# EAGLE design AeroQuad_v17 (EAGLE 5.07)
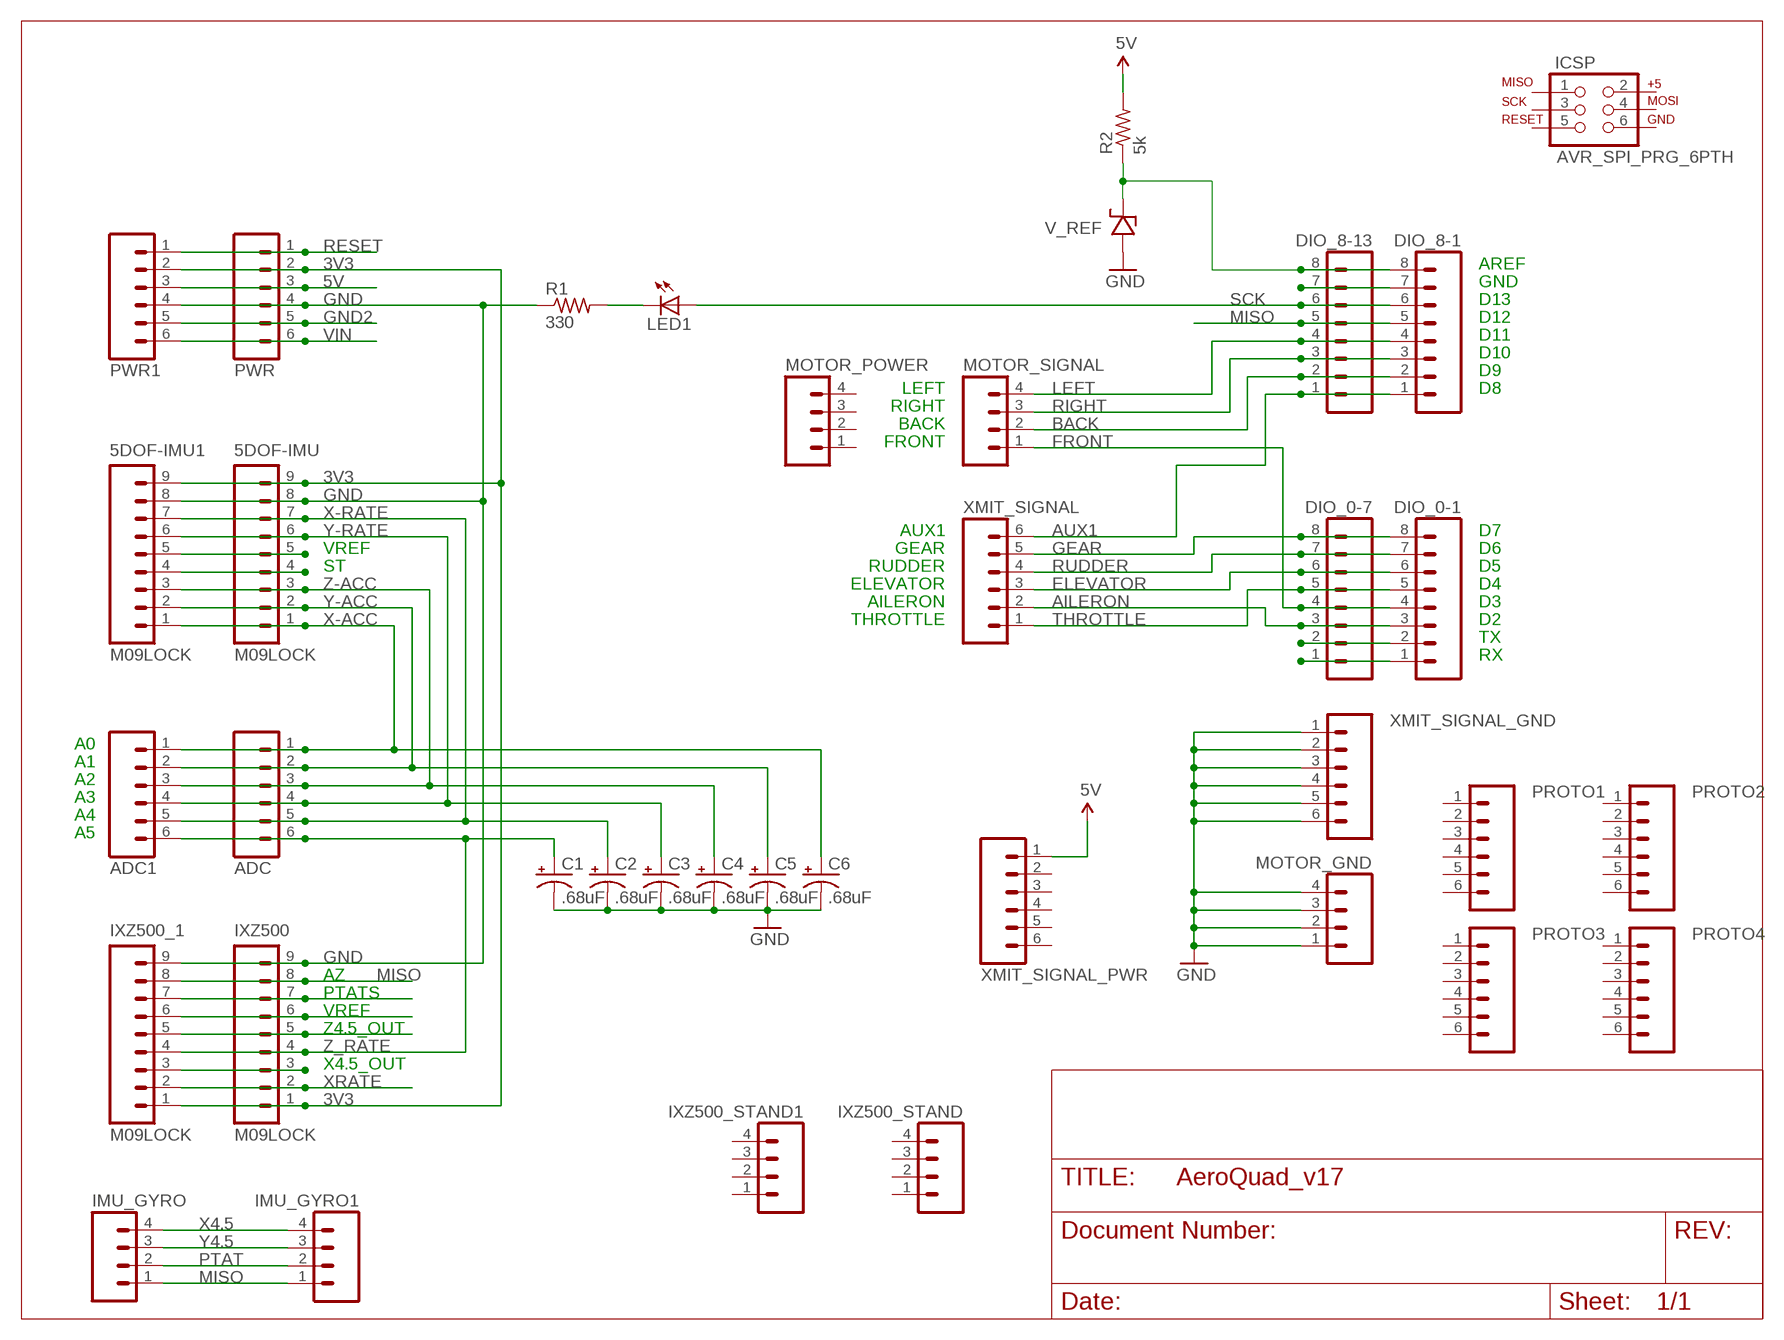
[diagram p0: schematic, sheet 1]

## Parts
5DOF-IMU  M09LOCK  [1X09_LOCK]
5DOF-IMU1  M09LOCK  [1X09_LOCK]
ADC  M06LOCK  [1X06_LOCK]
ADC1  M06LOCK  [1X06_LOCK]
C1  .68uF  CAP_POLPTH2  [CPOL-RADIAL-10UF-25V]
C2  .68uF  CAP_POLPTH2  [CPOL-RADIAL-10UF-25V]
C3  .68uF  CAP_POLPTH2  [CPOL-RADIAL-10UF-25V]
C4  .68uF  CAP_POLPTH2  [CPOL-RADIAL-10UF-25V]
C5  .68uF  CAP_POLPTH2  [CPOL-RADIAL-10UF-25V]
C6  .68uF  CAP_POLPTH2  [CPOL-RADIAL-10UF-25V]
DIO_0-1  M08LOCK  [1X08_LOCK]
DIO_0-7  M08LOCK  [1X08_LOCK]
DIO_8-1  M08LOCK  [1X08_LOCK]
DIO_8-13  M08LOCK  [1X08_LOCK]
ICSP  AVR_SPI_PRG_6PTH  [2X3]
IMU_GYRO  M04LOCK  [1X04_LOCK]
IMU_GYRO1  M04LOCK  [1X04_LOCK]
IXZ500  M09LOCK  [1X09_LOCK]
IXZ500_1  M09LOCK  [1X09_LOCK]
IXZ500_STAND  M04LOCK  [1X04_LOCK]
IXZ500_STAND1  M04LOCK  [1X04_LOCK]
LED1  LED5MM  [LED5MM]
MOTOR_GND  M04LOCK  [1X04_LOCK]
MOTOR_POWER  M04LOCK  [1X04_LOCK]
MOTOR_SIGNAL  M04LOCK  [1X04_LOCK]
PROTO1  M06SIP  [1X06]
PROTO2  M06SIP  [1X06]
PROTO3  M06SIP  [1X06]
PROTO4  M06SIP  [1X06]
PWR  M06LOCK  [1X06_LOCK]
PWR1  M06LOCK  [1X06_LOCK]
R1  330  R-US_0204/5  [0204/5]
R2  5k  R-US_0204/5  [0204/5]
V_REF  LM4040-3V  [TO-92]
XMIT_SIGNAL  M06LOCK  [1X06_LOCK]
XMIT_SIGNAL_GND  M06LOCK  [1X06_LOCK]
XMIT_SIGNAL_PWR  M06LOCK  [1X06_LOCK]

## Nets
3V3: 5DOF-IMU1.9 5DOF-IMU.9 IXZ500.1 IXZ500_1.1 PWR1.2 PWR.2
5V: PWR1.3 PWR.3 R2.2 XMIT_SIGNAL_PWR.1
AILERON: DIO_0-1.3 DIO_0-7.3 XMIT_SIGNAL.2
AREF: DIO_8-1.8 DIO_8-13.8 R2.1 V_REF.2(CATHODE)
AUX1: DIO_8-1.1 DIO_8-13.1 XMIT_SIGNAL.6
BACK: DIO_8-1.2 DIO_8-13.2 MOTOR_SIGNAL.2
ELEVATOR: DIO_0-1.6 DIO_0-7.6 XMIT_SIGNAL.3
FRONT: DIO_0-1.4 DIO_0-7.4 MOTOR_SIGNAL.1
GEAR: DIO_0-1.8 DIO_0-7.8 XMIT_SIGNAL.5
GND: 5DOF-IMU1.8 5DOF-IMU.8 C1.2(-) C2.2(-) C3.2(-) C4.2(-) C5.2(-) C6.2(-) IXZ500.9 IXZ500_1.9 MOTOR_GND.1 MOTOR_GND.2 MOTOR_GND.3 MOTOR_GND.4 PWR1.4 PWR.4 R1.1 V_REF.1(ANODE) XMIT_SIGNAL_GND.1 XMIT_SIGNAL_GND.2 XMIT_SIGNAL_GND.3 XMIT_SIGNAL_GND.4 XMIT_SIGNAL_GND.5 XMIT_SIGNAL_GND.6
GND2: PWR1.5 PWR.5
LEFT: DIO_8-1.4 DIO_8-13.4 MOTOR_SIGNAL.4
MISO: DIO_8-1.5 DIO_8-13.5 IMU_GYRO1.1 IMU_GYRO.1 IXZ500.8 IXZ500_1.8
N$1: DIO_8-1.7 DIO_8-13.7
N$2: LED1.K(C) R1.2
N$9: 5DOF-IMU1.5 5DOF-IMU.5
N$11: 5DOF-IMU1.4 5DOF-IMU.4
N$13: IXZ500.7 IXZ500_1.7
N$15: IXZ500.6 IXZ500_1.6
N$16: IXZ500.5 IXZ500_1.5
N$18: IXZ500.3 IXZ500_1.3
N$25: DIO_0-1.2 DIO_0-7.2
N$26: DIO_0-1.1 DIO_0-7.1
PTAT: IMU_GYRO1.2 IMU_GYRO.2
RESET: PWR1.1 PWR.1
RIGHT: DIO_8-1.3 DIO_8-13.3 MOTOR_SIGNAL.3
RUDDER: DIO_0-1.7 DIO_0-7.7 XMIT_SIGNAL.4
SCK: DIO_8-1.6 DIO_8-13.6 LED1.A
THROTTLE: DIO_0-1.5 DIO_0-7.5 XMIT_SIGNAL.1
VIN: PWR1.6 PWR.6
X4.5: IMU_GYRO1.4 IMU_GYRO.4
X-ACC: 5DOF-IMU1.1 5DOF-IMU.1 ADC1.1 ADC.1 C6.1(+)
X-RATE: 5DOF-IMU1.7 5DOF-IMU.7 ADC1.5 ADC.5 C2.1(+)
XRATE: IXZ500.2 IXZ500_1.2
Y4.5: IMU_GYRO1.3 IMU_GYRO.3
Y-ACC: 5DOF-IMU1.2 5DOF-IMU.2 ADC1.2 ADC.2 C5.1(+)
Y-RATE: 5DOF-IMU1.6 5DOF-IMU.6 ADC1.4 ADC.4 C3.1(+)
Z-ACC: 5DOF-IMU1.3 5DOF-IMU.3 ADC1.3 ADC.3 C4.1(+)
Z_RATE: ADC1.6 ADC.6 C1.1(+) IXZ500.4 IXZ500_1.4
Unconnected: ICSP.1 ICSP.2 ICSP.3 ICSP.4 ICSP.5 ICSP.6 IXZ500_STAND1.1 IXZ500_STAND1.2 IXZ500_STAND1.3 IXZ500_STAND1.4 IXZ500_STAND.1 IXZ500_STAND.2 IXZ500_STAND.3 IXZ500_STAND.4 MOTOR_POWER.1 MOTOR_POWER.2 MOTOR_POWER.3 MOTOR_POWER.4 PROTO1.1 PROTO1.2 PROTO1.3 PROTO1.4 PROTO1.5 PROTO1.6 PROTO2.1 PROTO2.2 PROTO2.3 PROTO2.4 PROTO2.5 PROTO2.6 PROTO3.1 PROTO3.2 PROTO3.3 PROTO3.4 PROTO3.5 PROTO3.6 PROTO4.1 PROTO4.2 PROTO4.3 PROTO4.4 PROTO4.5 PROTO4.6 V_REF.3(NC) XMIT_SIGNAL_PWR.2 XMIT_SIGNAL_PWR.3 XMIT_SIGNAL_PWR.4 XMIT_SIGNAL_PWR.5 XMIT_SIGNAL_PWR.6

## Notes on the sheet
- AREF
- GND
- D13
- D12
- D11
- D10
- D9
- LEFT | D8
- RIGHT
- BACK
- FRONT
- AUX1 | D7
- VREF | GEAR | D6
- ST | RUDDER | D5
- ELEVATOR | D4
- AILERON | D3
- THROTTLE | D2
- TX
- RX
- A0
- A1
- A2
- A3
- A4
- A5
- AZ
- PTATS
- VREF
- Z4.5_OUT
- X4.5_OUT

## Library data of the parts
5DOF-IMU 5DOF-IMU1 IXZ500 IXZ500_1 = SparkFun:M09: Header 9 Standard 9-pin 0.1" header. Use with straight break away headers (SKU : PRT-00116), right angle break away headers (PRT-00553), swiss pins (PRT-00743), machine pins (PRT-00117), and female headers (PRT-00115).
ADC ADC1 PROTO1-PROTO4 PWR PWR1 XMIT_SIGNAL XMIT_SIGNAL_GND XMIT_SIGNAL_PWR = SparkFun:M06: Header 6 Standard 6-pin 0.1" header. Use with straight break away headers (SKU : PRT-00116), right angle break away headers (PRT-00553), swiss pins (PRT-00743), machine pins (PRT-00117), and female headers (PRT-00115). Molex polarized connector foot print use with SKU : PRT-08094 with associated crimp pins and housings. NOTES ON THE VARIANTS LOCK and LOCK_LONGPADS... This footprint was designed to help hold the alignment of a through-hole component (i.e. 6-pin header) while soldering it into place. You may notice that each hole has been shifted either up or down by 0.005 of an inch from it's more standard position (which is a perfectly straight line). This slight alteration caused the pins (the squares in the middle) to touch the edges of the holes. Because they are alternating, it causes a "brace" to hold the component in place. 0.005 has proven to be the perfect amount of "off-center" position when using our standard breakaway headers. Although looks a little odd when you look at the bare footprint, once you have a header in there, the alteration is very hard to notice. Also, if you push a header all the way into place, it is covered up entirely on the bottom side. This idea of altering the position of holes to aid alignment will be further integrated into the Sparkfun Library for other footprints. It can help hold any component with 3 or more connection pins.
C1-C6 = SparkFun:CAP_POL: Capacitor Polarized These are standard SMD and PTH capacitors. Normally 10uF, 47uF, and 100uF in electrolytic and tantalum varieties. Always verify the external diameter of the through hole cap, it varies with capacity, voltage, and manufacturer. The EIA devices should be standard.
DIO_0-1 DIO_0-7 DIO_8-1 DIO_8-13 = SparkFun:M08: Header 8 Standard 8-pin 0.1" header. Use with straight break away headers (SKU : PRT-00116), right angle break away headers (PRT-00553), swiss pins (PRT-00743), machine pins (PRT-00117), and female headers (PRT-00115).
ICSP = SparkFun:AVR_SPI_PRG_6: AVR ISP 6 Pin This is the reduced ISP connector for AVR programming. Common on Arduino. This footprint will take up less PCB space and can be used with a 10-pin to 6-pin adapter such as SKU: BOB-08508
IMU_GYRO IMU_GYRO1 IXZ500_STAND IXZ500_STAND1 MOTOR_GND MOTOR_POWER MOTOR_SIGNAL = SparkFun:M04: Header 4 Standard 4-pin 0.1" header. Use with straight break away headers (SKU : PRT-00116), right angle break away headers (PRT-00553), swiss pins (PRT-00743), machine pins (PRT-00117), and female headers (PRT-00115). Molex polarized connector foot print use with SKU : PRT-08231 with associated crimp pins and housings.
LED1 = SparkFun:LED: LEDs Standard schematic elements and footprints for 5mm, 3mm, 1206, and 0603 sized LEDs. 5mm - Spark Fun Electronics SKU : COM-00529 (and others)
R1 R2 = resistor:R-US_: RESISTOR, American symbol
V_REF = CaranchoEngineering:LM4040: The LM4040 series of shunt voltage references are versatile, easy-to-use references that cater to a vast array of applications. The 2-pin fixed-output device requires no external capacitors for operation and is stable with all capacitive loads. Additionally, the reference offers low dynamic impedance, low noise, and low temperature coefficient to ensure a stable output voltage over a wide range of operating currents and temperatures.

## Board
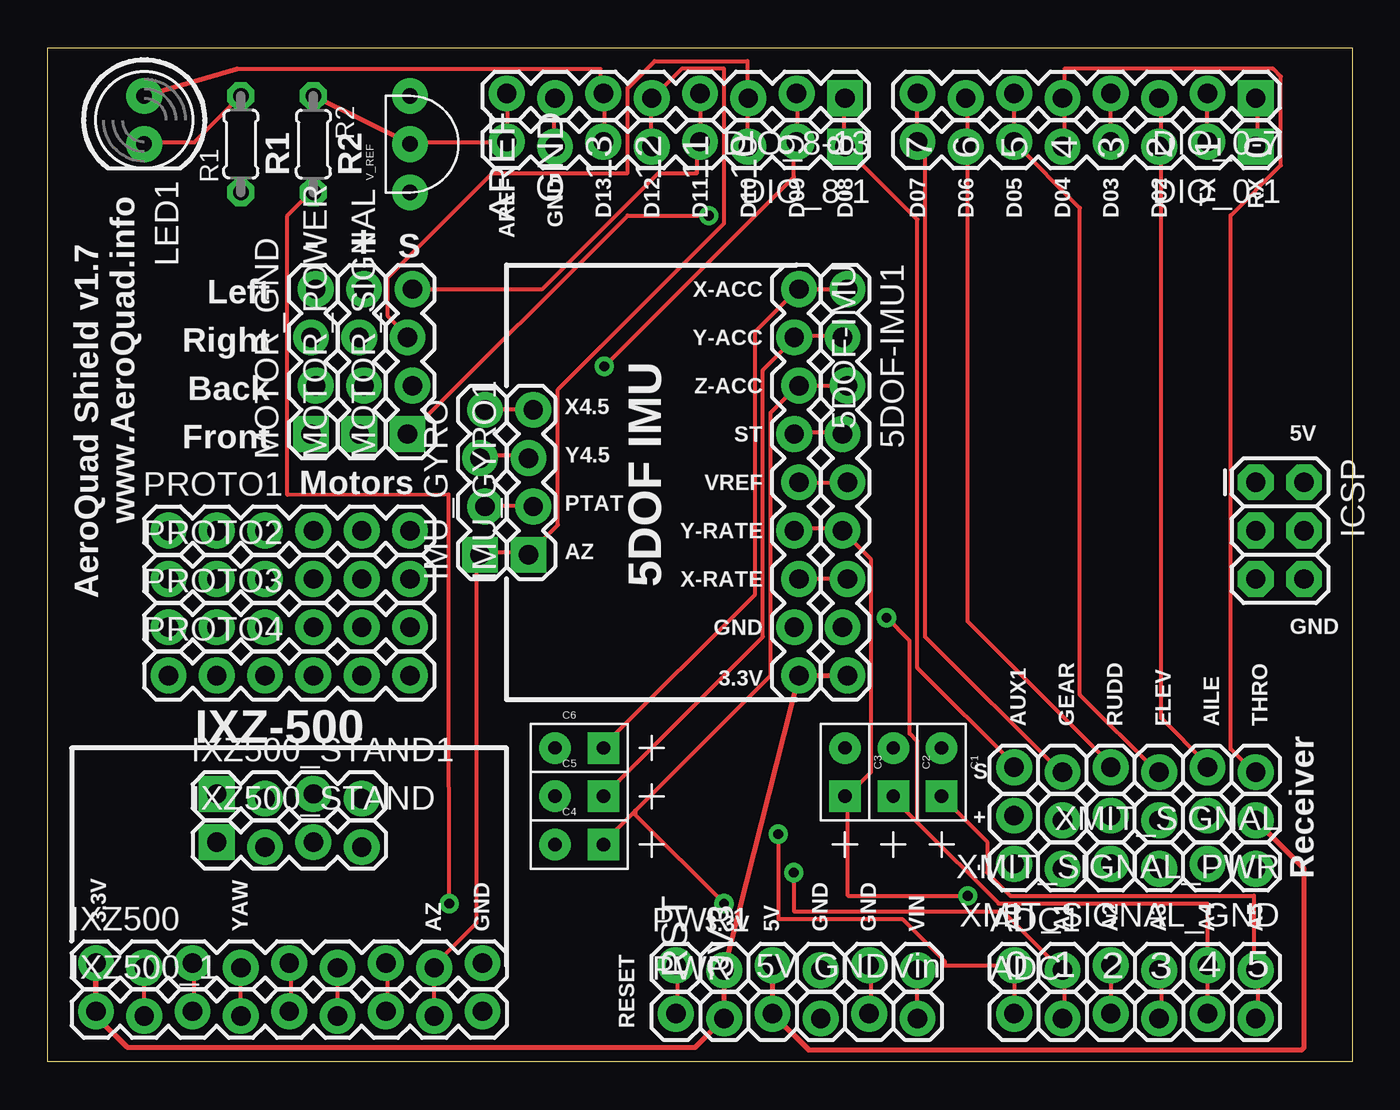
[diagram p1: board, top side]
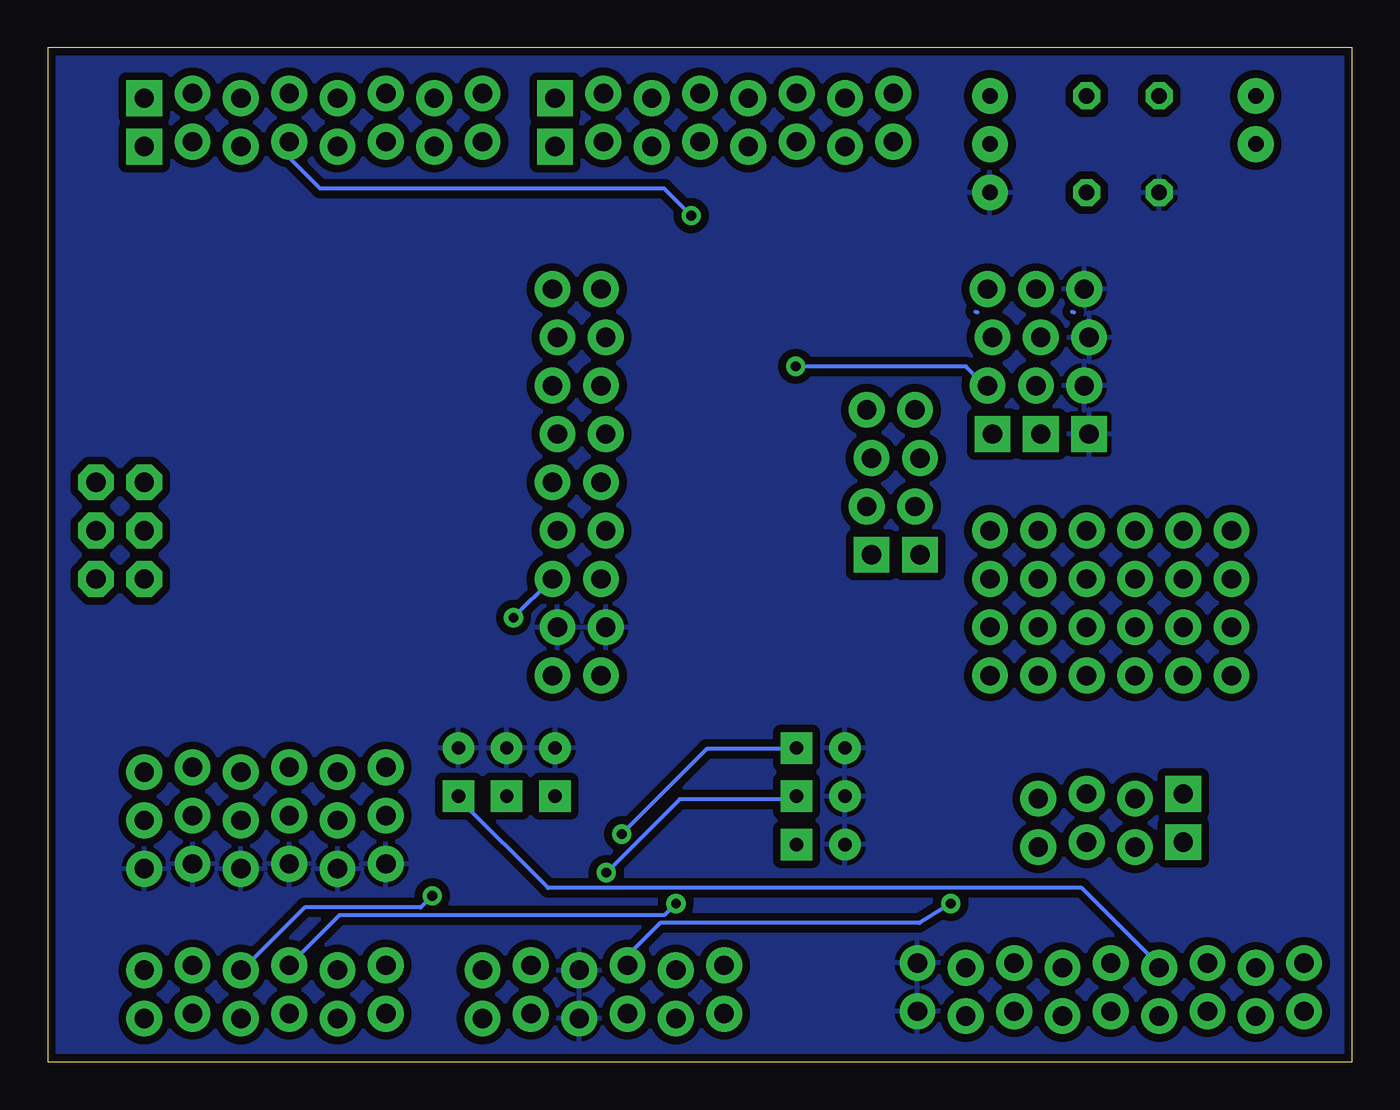
[diagram p2: board, bottom side, seen from below]

Size 68.58 x 53.34 mm. Coordinates in mm from the lower left corner, seen from the top.
Outline: 0,53.34 68.58,53.34 68.58,0 0,0 0,53.34
Copper layers (1*16): Top 0.035mm / dielectric 1.5mm / Bottom 0.035mm
Design rules "SparkFun": minimum track width 8mil, minimum drill 20mil, track to track 8mil, track to pad 8mil, pad to pad 8mil, via to via 8mil, smd to smd 8mil, copper to edge 10mil, drill to drill 8mil, minimum pad ring 12mil, minimum via ring 10mil, stop-mask expansion 4mil, vias tented up to drill 25mil, thermal gap 10mil

### Footprints (pad centres in the part's own frame; a part is rotated, then mirrored left to right if it is on the bottom)
1X09_LOCK = drill 1.016 pad 1.88 round: 1 0,0.127; 2 2.54,-0.127; 3 5.08,0.127; 4 7.62,-0.127; 5 10.16,0.127; 6 12.7,-0.127; 7 15.24,0.127; 8 17.78,-0.127; 9 20.32,0.127
1X06_LOCK = drill 1.016 pad 1.88 round: 1 0,0; 2 2.54,-0.254; 3 5.08,0; 4 7.62,-0.254; 5 10.16,0; 6 12.7,-0.254
CPOL-RADIAL-10UF-25V = drill 0.7 pad 1.651 square: 1 1.27,0 | drill 0.7 pad 1.651 round: 2 -1.27,0
1X08_LOCK = drill 1.016 pad 1.88 square: 1 0,0.127 | drill 1.016 pad 1.88 round: 2 2.54,-0.127; 3 5.08,0.127; 4 7.62,-0.127; 5 10.16,0.127; 6 12.7,-0.127; 7 15.24,0.127; 8 17.78,-0.127
2X3 = drill 1.016 pad 1.88 octagon: 1 0,0; 2 0,2.54; 3 2.54,0; 4 2.54,2.54; 5 5.08,0; 6 5.08,2.54
1X04_LOCK = drill 1.016 pad 1.88 square: 1 0,0.127 | drill 1.016 pad 1.88 round: 2 2.54,-0.127; 3 5.08,0.127; 4 7.62,-0.127
LED5MM = drill 0.813 pad 1.88 round: A -1.27,0; K 1.27,0
1X06 = drill 1.016 pad 1.88 round: 1 0,0; 2 2.54,0; 3 5.08,0; 4 7.62,0; 5 10.16,0; 6 12.7,0
0204/5 = drill 0.813 octagon: 1 -2.54,0; 2 2.54,0
TO-92 = drill 0.813 pad 1.88 round: 1 -2.54,0; 2 0,0; 3 2.54,0

### Placement (x,y rotation side)
5DOF-IMU  39.37,40.64 270 top
5DOF-IMU1  41.91,40.64 270 top
ADC  50.8,2.54 0 top
ADC1  50.8,5.08 0 top
C1  46.99,15.24 270 top
C2  44.45,15.24 270 top
C3  41.91,15.24 270 top
C4  27.94,11.43 0 top
C5  27.94,13.97 0 top
C6  27.94,16.51 0 top
DIO_0-1  63.5,48.26 180 top
DIO_0-7  63.5,50.8 180 top
DIO_8-1  41.91,48.26 180 top
DIO_8-13  41.91,50.8 180 top
ICSP  63.5,30.48 270 top
IMU_GYRO  22.86,26.67 90 top
IMU_GYRO1  25.4,26.67 90 top
IXZ500  2.54,5.08 0 top
IXZ500_1  2.54,2.54 0 top
IXZ500_STAND  8.89,11.43 0 top
IXZ500_STAND1  8.89,13.97 0 top
LED1  5.08,49.53 270 top
MOTOR_GND  13.97,33.02 90 top
MOTOR_POWER  16.51,33.02 90 top
MOTOR_SIGNAL  19.05,33.02 90 top
PROTO1  6.35,27.94 0 top
PROTO2  6.35,25.4 0 top
PROTO3  6.35,22.86 0 top
PROTO4  6.35,20.32 0 top
PWR  33.02,2.54 0 top
PWR1  33.02,5.08 0 top
R1  10.16,48.26 90 top
R2  13.97,48.26 270 top
V_REF  19.05,48.26 90 top
XMIT_SIGNAL  63.5,15.24 180 top
XMIT_SIGNAL_GND  63.5,10.16 180 top
XMIT_SIGNAL_PWR  63.5,12.7 180 top

### Tracks (layer width: path | path; a pad name or v marks a point on that pad's centre or on a via)
3V3
  Top 0.254: IXZ500_1.1 IXZ500.1 2.54,2.41 4.19,0.76 34.04,0.76 PWR.2 PWR1.2 5DOF-IMU.9 5DOF-IMU1.9
5V  (via drill 0.51)
  Top 0.203: v21.11,8.33 21.11,10.57 21.08,18.34 21.08,29.84 12.6,29.82 12.6,44.5 13.82,45.72 R2.2
  Top 0.254: XMIT_SIGNAL_PWR.1 66.04,10.16 66.04,0.76 65.91,0.64 40.01,0.64 PWR.3 PWR1.3
  Bottom 0.203: v21.11,8.33 22.76,7.32 36.37,7.32 38,5.69 38,5.08 PWR1.3
AILERON
  Top 0.203: DIO_0-7.3 58.52,50.6 58.52,48.16 DIO_0-1.3 58.52,47.95 58.52,18.09 60.96,15.65 XMIT_SIGNAL.2
AREF
  Top 0.203: DIO_8-13.8 24.18,50.8 24.18,48.56 DIO_8-1.8 23.98,48.36 19.1,48.36 V_REF.2 18.9,48.36
  Top 0.254: R2.1 18.9,48.36
AUX1
  Top 0.203: DIO_8-13.1 41.86,50.6 41.86,48.16 DIO_8-1.1 42.06,47.95 45.72,44.3 45.72,20.73 50.8,15.65 XMIT_SIGNAL.6
BACK  (via drill 0.51)
  Top 0.203: v29.26,36.58 39.22,46.53 39.22,48.36 DIO_8-1.2 39.42,48.56 39.42,50.8 DIO_8-13.2
  Bottom 0.203: v29.26,36.58 20.32,36.58 19.3,35.56 MOTOR_SIGNAL.2
ELEVATOR
  Top 0.203: DIO_0-7.6 DIO_0-1.6 50.8,48.36 54.25,44.91 54.25,19.3 58.32,15.24 XMIT_SIGNAL.3
FRONT  (via drill 0.51)
  Top 0.203: v34.75,44.5 30.48,44.5 19.1,33.12 MOTOR_SIGNAL.1 | DIO_0-1.4 DIO_0-7.4
  Bottom 0.203: v34.75,44.5 36.17,45.92 54.25,45.92 55.88,47.55 DIO_0-1.4
GEAR
  Top 0.203: DIO_0-7.8 DIO_0-1.8 45.72,48.36 46.13,47.95 46.13,22.35 53.24,15.24 XMIT_SIGNAL.5
GND
  pour Bottom (isolate 0.406): 0,53.34 68.58,53.34 68.58,0 0,0
GND2
  Top 0.203: PWR.5 43.28,2.64 43.28,5.08 PWR1.5
LEFT
  Top 0.203: MOTOR_SIGNAL.4 26.01,40.64 32.11,46.74 34.14,46.74 34.14,48.36 DIO_8-1.4 34.34,48.56 34.34,50.8 DIO_8-13.4
MISO
  Top 0.203: DIO_8-1.5 31.7,48.16 31.7,50.6 DIO_8-13.5 31.9,50.8 33.33,52.22 35.56,52.22 35.56,44.09 26.82,35.36 26.82,28.25 25.4,26.82 IMU_GYRO1.1 25.2,26.82 22.76,26.82 IMU_GYRO.1 22.55,26.62 22.55,7.32 20.32,5.08 IXZ500.8 IXZ500_1.8
N$1
  Top 0.203: DIO_8-1.7 26.62,48.16 26.62,50.6 DIO_8-13.7
N$2
  Top 0.203: R1.2 7.72,48.36 5.08,48.36 LED1.K
N$7
  Bottom 0.203: 19.81,39.45 19.71,39.42
N$9
  Top 0.203: 5DOF-IMU.5 5DOF-IMU1.5
N$10
  Bottom 0.203: 14.73,39.45 14.63,39.42
N$11
  Top 0.203: 5DOF-IMU.4 39.42,33.12 41.66,33.12 5DOF-IMU1.4
N$13
  Top 0.203: IXZ500_1.7 17.88,2.85 17.88,5.08 IXZ500.7
N$15
  Top 0.203: IXZ500_1.6 IXZ500.6
N$16
  Top 0.203: IXZ500_1.5 12.8,2.85 12.8,5.08 IXZ500.5
N$18
  Top 0.203: IXZ500_1.3 7.72,2.85 7.72,5.08 IXZ500.3
N$25
  Top 0.203: DIO_0-1.2 DIO_0-7.2
N$26
  Top 0.203: DIO_0-1.1 63.6,48.16 63.6,50.6 DIO_0-7.1
PTAT
  Top 0.203: IMU_GYRO.2 23.16,29.26 25.4,29.26 IMU_GYRO1.2
RESET
  Top 0.203: PWR.1 33.12,2.64 33.12,5.08 PWR1.1
RIGHT
  Top 0.203: MOTOR_SIGNAL.3 18.9,38.2 17.88,39.22 17.88,41.25 23.37,46.74 30.48,46.74 30.48,51.21 31.9,52.63 36.78,52.63 36.78,50.8 DIO_8-13.3 36.78,50.6 36.78,48.16 DIO_8-1.3
RUDDER
  Top 0.203: DIO_0-7.7 48.36,50.6 48.36,48.16 DIO_0-1.7 48.36,47.95 48.36,23.16 55.88,15.65 XMIT_SIGNAL.4
SCK
  Top 0.203: 9.96,52.22 29.06,52.22 29.06,51 DIO_8-13.6 29.26,50.8 29.26,48.56 DIO_8-1.6
  Top 0.254: LED1.A 9.96,52.22
THROTTLE
  Top 0.203: DIO_0-1.5 53.44,48.16 53.44,50.6 DIO_0-7.5 53.44,50.8 53.44,52.22 64.41,52.22 64.82,51.82 64.82,47.14 62.18,44.5 62.18,16.46 63.4,15.24 XMIT_SIGNAL.1
VIN
  Top 0.203: PWR.6 PWR1.6
X4.5
  Top 0.203: IMU_GYRO.4 23.16,34.34 25.4,34.34 IMU_GYRO1.4
X-ACC  (via drill 0.51)
  Top 0.203: ADC.1 ADC1.1 47.14,5.08 47.14,5.28 44.91,7.52 38.41,7.52 v38.41,11.99 | C6.1 29.26,16.66 37.19,24.59 37.19,38.41 39.42,40.64 5DOF-IMU.1 5DOF-IMU1.1
  Bottom 0.203: v38.41,11.99 33.93,16.46 29.26,16.46 C6.1
X-RATE  (via drill 0.51)
  Top 0.203: 5DOF-IMU1.7 5DOF-IMU.7 | 45.72,12.6 49.99,8.33 60.96,8.33 ADC1.5 ADC.5 | 45.72,12.6 44.5,13.82 C2.1 | v44.09,23.37 45.31,22.15 45.31,17.27 45.72,16.87 45.72,12.6
  Bottom 0.203: v44.09,23.37 42.06,25.4 5DOF-IMU1.7
XRATE
  Top 0.203: IXZ500_1.2 IXZ500.2
Y4.5
  Top 0.203: IMU_GYRO.3 22.76,31.9 25.2,31.9 IMU_GYRO1.3
Y-ACC  (via drill 0.51)
  Top 0.203: ADC.2 53.44,2.44 53.44,4.67 ADC1.2 53.24,4.88 50.19,7.92 39.22,7.92 v39.22,9.96 | C5.1 37.59,22.35 37.59,36.37 39.22,38 5DOF-IMU.2 39.42,38.2 41.66,38.2 5DOF-IMU1.2
  Bottom 0.203: v39.22,9.96 35.36,13.82 29.26,13.82 C5.1
Y-RATE  (via drill 0.51)
  Top 0.203: ADC.4 58.52,2.44 58.52,4.67 ADC1.4 | 5DOF-IMU.6 39.42,28.04 41.66,28.04 5DOF-IMU1.6 41.86,27.84 43.28,26.42 43.28,15.24 42.06,14.02 C3.1 42.06,13.82 42.06,8.74 v48.36,8.74
  Bottom 0.203: v48.36,8.74 48.97,8.13 55.07,8.13 58.32,4.88 ADC1.4
Z-ACC  (via drill 0.51)
  Top 0.203: ADC1.3 ADC.3 | 30.89,13.21 38,20.32 38,34.14 39.42,35.56 5DOF-IMU.3 5DOF-IMU1.3 | 30.89,13.21 29.26,11.58 C4.1 | v35.56,8.33 30.89,13.01 30.89,13.21
  Bottom 0.203: ADC1.3 53.24,7.72 36.17,7.72 v35.56,8.33
Z_RATE
  Top 0.203: IXZ500_1.4 IXZ500.4 | C1.1 49.38,11.58 49.38,9.96 50.6,8.74 63.4,8.74 63.4,4.88 ADC1.6 63.6,4.67 63.6,2.44 ADC.6
  Bottom 0.203: IXZ500.4 10.16,5.08 14.22,9.14 42.27,9.14 46.94,13.82 C1.1

### Text on the board
tPlace: R1 | R2 | AREF | GND | D13 | D12 | D11 | D10 | D09 | D08 | D07 | D06 | D05 | D04 | D03 | D02 | TX | RX | - | + | S | Left | X-ACC | Right | Y-ACC | 5DOF IMU | Back | Z-ACC | Front | X4.5 | ST | 5V | Y4.5 | VREF | Motors | PTAT | www.AeroQuad.info | Y-RATE | AZ | X-RATE | AeroQuad Shield v1.7 | GND | GND | 3.3V | AUX1 | GEAR | RUDD | ELEV | AILE | THRO | IXZ-500 | Receiver | S | + | 3.3V | - | YAW | AZ | GND | 3.3V | 5V | GND | GND | VIN | A0 | A1 | A2 | A3 | A4 | A5 | RESET
tNames: 9 | 8 | 7 | 6 | 5 | 4 | 3 | 2 | 1 | 0 | 13 | 12 | 11 | 10 | GND | AREF | RST | 3V3 | 5V | GND | Vin | 0 | 1 | 2 | 3 | 4 | 5